# EAGLE schematic CapacitanceSelector (EAGLE 7.5.0)
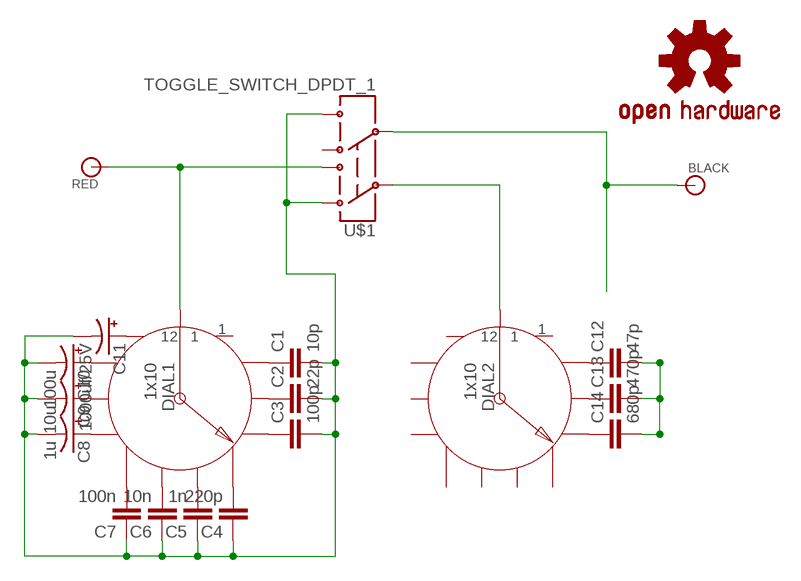
[diagram p0: schematic, sheet 1]

## Parts
BLACK  BANANA_CONN  [BANANA_CONN]
C1  10p  0.1UF-50V-20%(PTH)KIT-EZ  [CAP-PTH-SMALL-KIT]
C2  22p  0.1UF-50V-20%(PTH)KIT-EZ  [CAP-PTH-SMALL-KIT]
C3  100p  0.1UF-50V-20%(PTH)KIT-EZ  [CAP-PTH-SMALL-KIT]
C4  220p  0.1UF-50V-20%(PTH)KIT-EZ  [CAP-PTH-SMALL-KIT]
C5  1n  0.1UF-50V-20%(PTH)KIT-EZ  [CAP-PTH-SMALL-KIT]
C6  10n  0.1UF-50V-20%(PTH)KIT-EZ  [CAP-PTH-SMALL-KIT]
C7  100n  0.1UF-50V-20%(PTH)KIT-EZ  [CAP-PTH-SMALL-KIT]
C8  1u  10UF-25V-20%(PTH)KIT  [CPOL-RADIAL-10UF-25V-KIT]
C9  10u  10UF-25V-20%(PTH)KIT  [CPOL-RADIAL-10UF-25V-KIT]
C10  100u  10UF-25V-20%(PTH)KIT  [CPOL-RADIAL-10UF-25V-KIT]
C11  1000uf/25V  1000UF-25V(PTH)KIT  [CPOL-RADIAL-1000UF-25V-KIT]
C12  47p  CAP_  [AXIAL-5MM]
C13  470p  0.1UF-50V-20%(PTH)KIT-EZ  [CAP-PTH-SMALL-KIT]
C14  680p  0.1UF-50V-20%(PTH)KIT-EZ  [CAP-PTH-SMALL-KIT]
DIAL1  1x10  SWITCH_ROTARY_1X12  [ROTARY_SWITCH_1X12]
DIAL2  1x10  SWITCH_ROTARY_1X12  [ROTARY_SWITCH_1X12]
LOGO1  OSHW-LOGOL  [OSHW-LOGO-L]
RED  BANANA_CONN  [BANANA_CONN]
U$1  TOGGLE_SWITCH_DPDT_1  [TOGGLE_SWITCH_1]

## Nets
N$1: DIAL1.COMMON RED.P$1 U$1.P$2
N$2: C12.P$1 DIAL2.2
N$3: BLACK.P$1 U$1.P$4
N$4: DIAL2.COMMON U$1.P$3
N$5: C5.2 DIAL1.6
N$6: C1.1 DIAL1.2
N$7: C2.1 DIAL1.3
N$8: C3.1 DIAL1.4
N$9: C4.2 DIAL1.5
N$10: C6.2 DIAL1.7
N$11: C13.1 DIAL2.3
N$12: C1.2 C2.2 C3.2 C4.1 C5.1 C6.1 C7.1 C8.2(-) C9.2(-) C10.2(-) C11.- U$1.P$1 U$1.P$6
N$13: C8.1(+) DIAL1.9
N$14: C12.P$2 C13.2 C14.2
N$15: C14.1 DIAL2.4
N$16: C11.+ DIAL1.12
N$17: C7.2 DIAL1.8
N$20: C10.1(+) DIAL1.11
N$21: C9.1(+) DIAL1.10
Unconnected: DIAL1.1 DIAL2.1 DIAL2.5 DIAL2.6 DIAL2.7 DIAL2.8 DIAL2.9 DIAL2.10 DIAL2.11 DIAL2.12 U$1.P$5

## Library data of the parts
BLACK RED = SparkFun-Connectors:BANANA_CONN: Through-hole banana jack
C1-C7 C13 C14 = SparkFun-Capacitors:0.1UF-50V-20%(PTH): CAP-08370; PROD_ID: CAP-08370
C8-C10 = SparkFun-Capacitors:10UF-25V-20%(PTH): CAP-08440; PROD_ID: CAP-08440
C11 = SparkFun-Capacitors:1000UF-25V(PTH): CAP-08070; PROD_ID: CAP-09538
C12 = SparkFun-Capacitors:CAP: Capacitor Standard 0603 ceramic capacitor, and 0.1" leaded capacitor.
DIAL1 DIAL2 = HokieGeek:SWITCH_ROTARY_1X12: SWCH-12120; PROD_ID: SWCH-12120
LOGO1 = SparkFun-Aesthetics:OSHW-LOGO: Open Source Hardware Logo This logo indicates the piece of hardware it is found on incorporates a OSHW license and/or adheres to the definition of open source hardware found here: http://freedomdefined.org/OSHW
U$1 = HokieGeek:TOGGLE_SWITCH_DPDT_1